# Altium project TimeHAT.PrjPcb
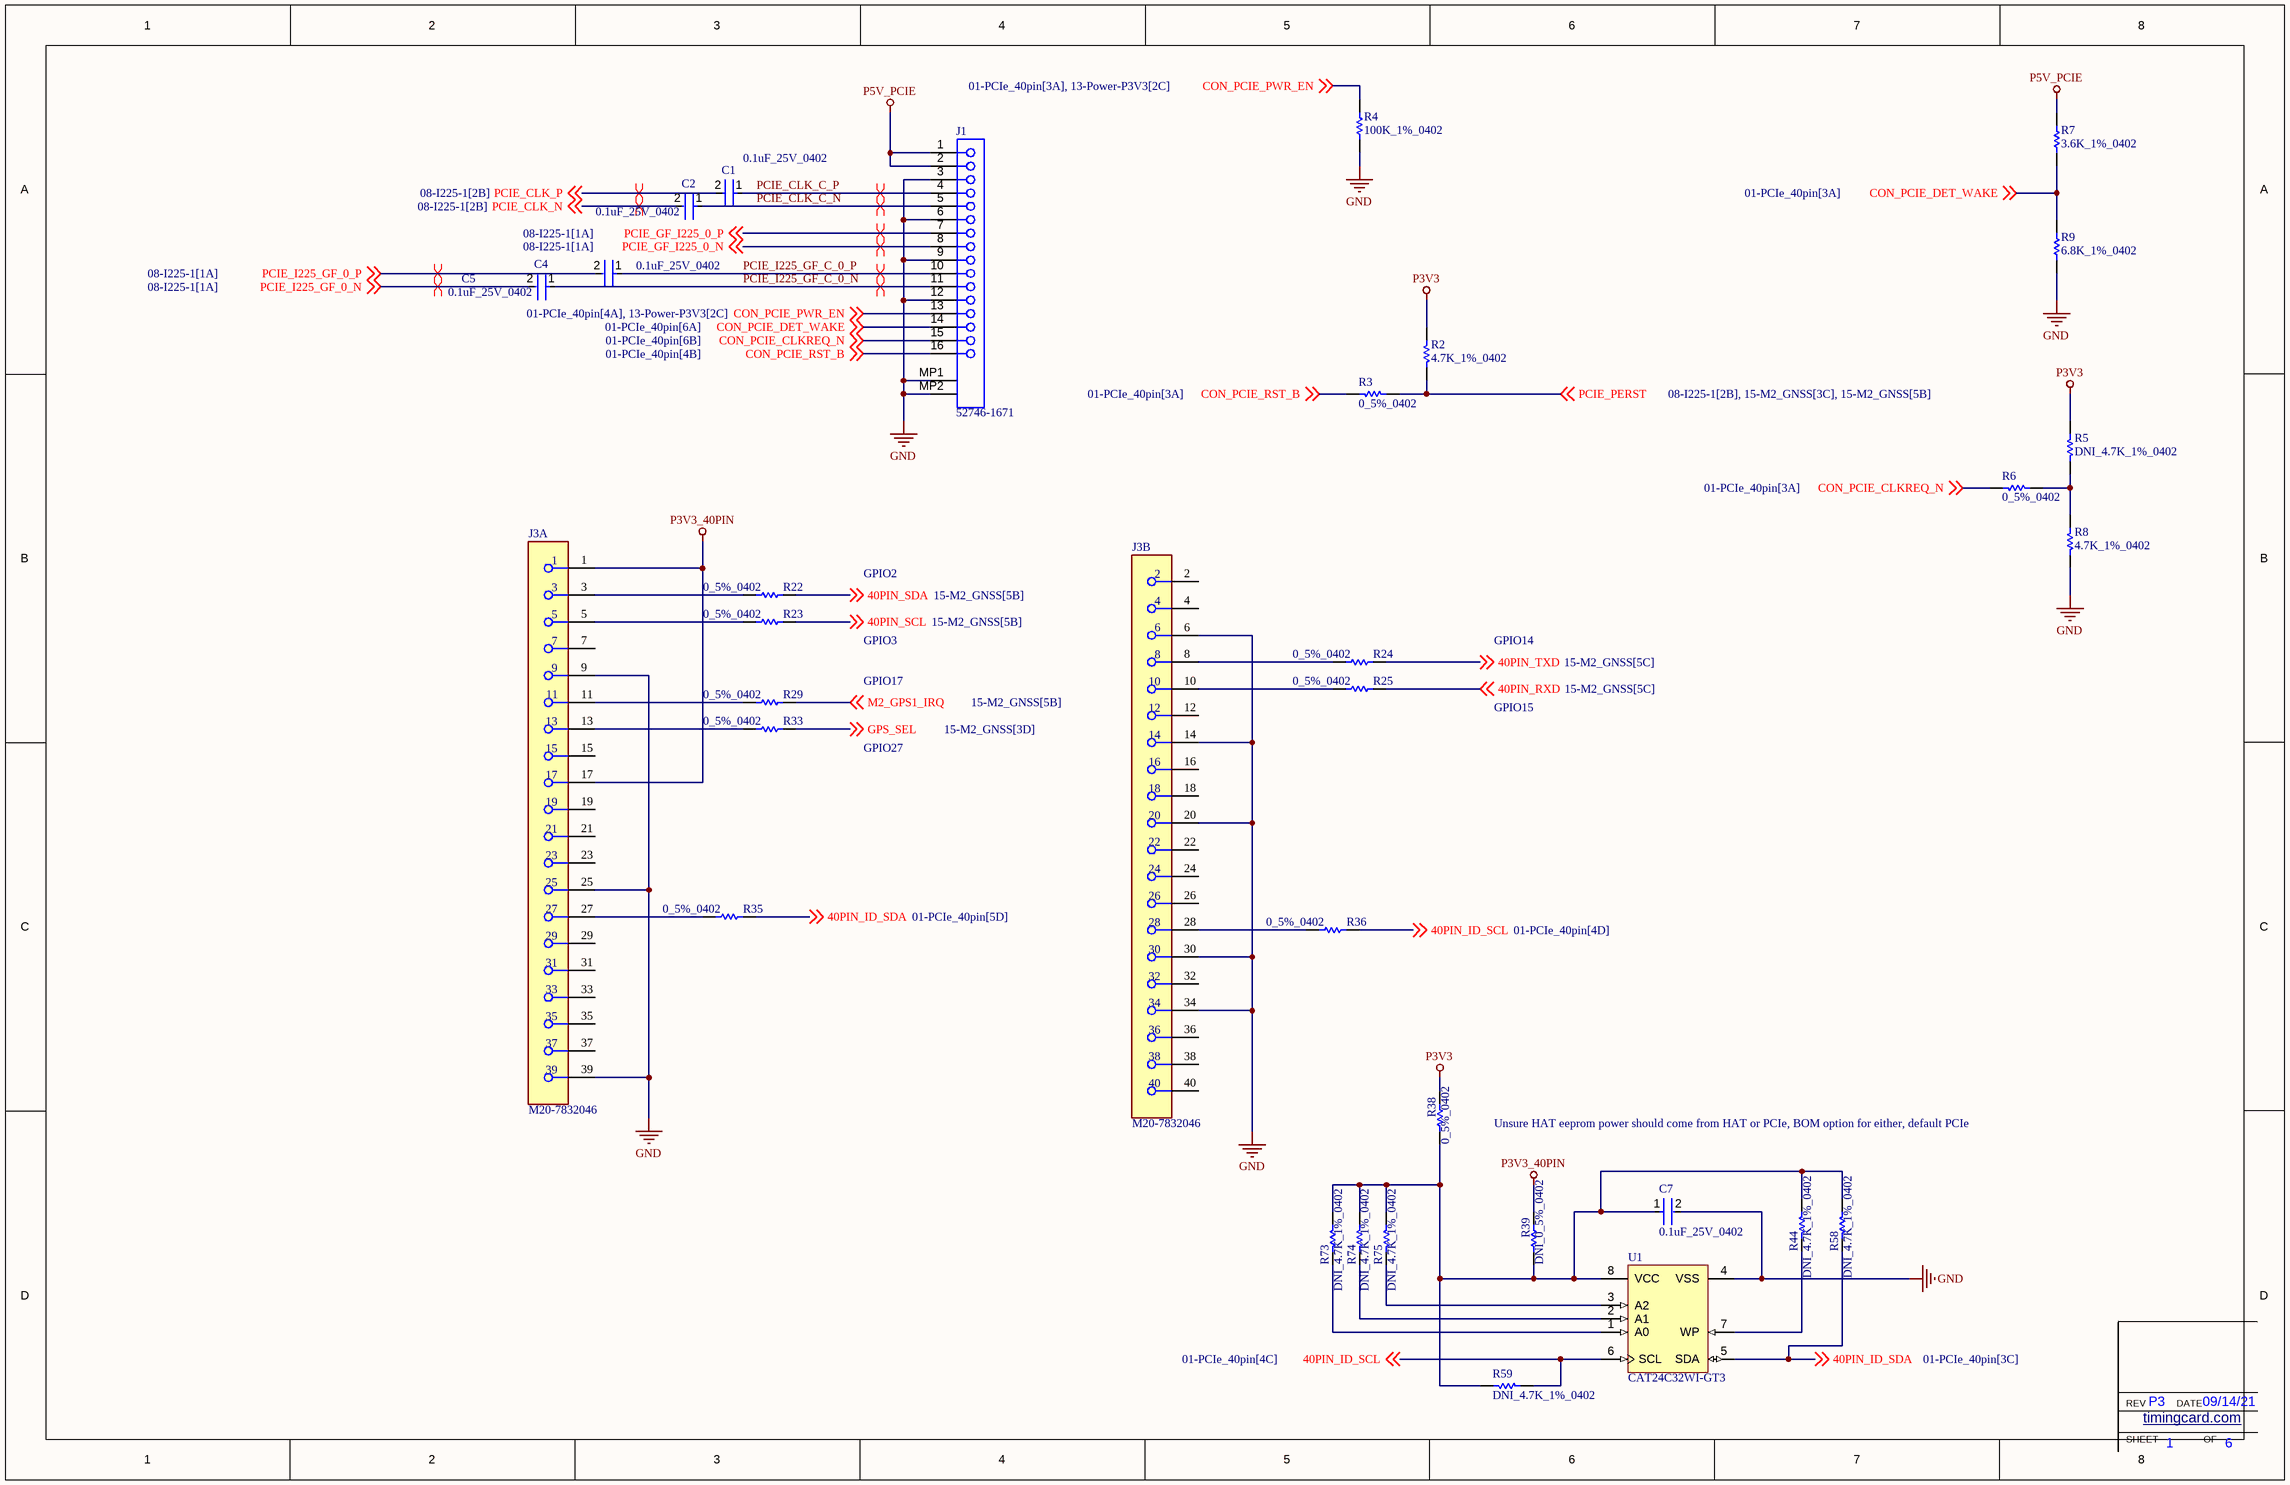
[diagram p0: 01-PCIe_40pin.SchDoc]
ProjectDate: 09/14/21; ProjectRevision: P3
4 sheets, 108 parts. Net scope: global (net labels, ports and power ports of the same name join across sheets).
Board file: TimeHAT.PcbDoc
Sheets:
  01-PCIe_40pin.SchDoc
  02-USER_IO.SchDoc
  08-I225-1.SchDoc
  15-M2_GNSS.SchDoc

## Sheet 01-PCIe_40pin.SchDoc
size Tabloid; Customer: 01910; SheetNumber: 1; SheetTotal: 6

### Parts
C1  0.1uF_25V_0402  [FP-0402-L_1_0_1-W_0_5_0_1-IPC_C]
C2  0.1uF_25V_0402  [FP-0402-L_1_0_1-W_0_5_0_1-IPC_C]
C4  0.1uF_25V_0402  [FP-0402-L_1_0_1-W_0_5_0_1-IPC_C]
C5  0.1uF_25V_0402  [FP-0402-L_1_0_1-W_0_5_0_1-IPC_C]
C7  0.1uF_25V_0402  [FP-0402-L_1_0_1-W_0_5_0_1-IPC_C]
J1  52746-1671  [MOLX-52746-1671]
J3  M20-7832046  [FP-M20-7832046-MFG]  (parts A,B of 2)
R2  4.7K_1%_0402  [RESC1005X40X25NL10T10]
R3  0_5%_0402  [RESC1005X40X25LL10T10]
R4  100K_1%_0402  [RESC1005X40X25ML05T10]
R5  DNI_4.7K_1%_0402  [RESC1005X40X25NL10T10]  (no BOM)
R6  0_5%_0402  [RESC1005X40X25LL10T10]
R7  3.6K_1%_0402  [RESC1005X40X25ML05T10]
R8  4.7K_1%_0402  [RESC1005X40X25NL10T10]
R9  6.8K_1%_0402  [RESC1005X40X25LL10T10]
R22  0_5%_0402  [RESC1005X40X25LL10T10]
R23  0_5%_0402  [RESC1005X40X25LL10T10]
R24  0_5%_0402  [RESC1005X40X25LL10T10]
R25  0_5%_0402  [RESC1005X40X25LL10T10]
R29  0_5%_0402  [RESC1005X40X25LL10T10]
R33  0_5%_0402  [RESC1005X40X25LL10T10]
R35  0_5%_0402  [RESC1005X40X25LL10T10]
R36  0_5%_0402  [RESC1005X40X25LL10T10]
R38  0_5%_0402  [RESC1005X40X25LL10T10]
R39  DNI_0_5%_0402  [RESC1005X40X25LL10T10]  (no BOM)
R44  DNI_4.7K_1%_0402  [RESC1005X40X25NL10T10]  (no BOM)
R58  DNI_4.7K_1%_0402  [RESC1005X40X25NL10T10]  (no BOM)
R59  DNI_4.7K_1%_0402  [RESC1005X40X25NL10T10]  (no BOM)
R73  DNI_4.7K_1%_0402  [RESC1005X40X25NL10T10]  (no BOM)
R74  DNI_4.7K_1%_0402  [RESC1005X40X25NL10T10]  (no BOM)
R75  DNI_4.7K_1%_0402  [RESC1005X40X25NL10T10]  (no BOM)
U1  CAT24C32WI-GT3  [ONSC-SOIC-8-751BD-01_M]

### Nets
GND: C7.2 J1.3 J1.6 J1.9 J1.12 J1.MP1 J1.MP2 J3.6 J3.9 J3.14 J3.20 J3.25 J3.30 J3.34 J3.39 R4.1 R8.1 R9.1 U1.4(VSS)
P3V3: R2.2 R5.2 R38.2
P3V3_40PIN: J3.1 J3.17 R39.2
P5V_PCIE: J1.1 J1.2 R7.2
40PIN_ID_SCL: R36.2 R59.1 U1.6(SCL) ; off-sheet 40PIN_ID_SCL
40PIN_ID_SDA: R35.2 R58.1 U1.5(SDA) ; off-sheet 40PIN_ID_SDA
40PIN_RXD: R25.2 ; off-sheet 40PIN_RXD
40PIN_SCL: R23.2 ; off-sheet 40PIN_SCL
40PIN_SDA: R22.2 ; off-sheet 40PIN_SDA
40PIN_TXD: R24.2 ; off-sheet 40PIN_TXD
CON_PCIE_CLKREQ_N: J1.15 R6.2 ; off-sheet CON_PCIE_CLKREQ_N
CON_PCIE_DET_WAKE: J1.14 R7.1 R9.2 ; off-sheet CON_PCIE_DET_WAKE
CON_PCIE_PWR_EN: J1.13 R4.2 ; off-sheet CON_PCIE_PWR_EN
CON_PCIE_RST_B: J1.16 R3.2 ; off-sheet CON_PCIE_RST_B
GPS_SEL: R33.2 ; off-sheet GPS_SEL
M2_GPS1_IRQ: R29.2 ; off-sheet M2_GPS1_IRQ
PCIE_CLK_C_N: C2.1 J1.5
PCIE_CLK_C_P: C1.1 J1.4
PCIE_CLK_N: C2.2 ; off-sheet PCIE_CLK_N
PCIE_CLK_P: C1.2 ; off-sheet PCIE_CLK_P
PCIE_GF_I225_0_N: J1.8 ; off-sheet PCIE_GF_I225_0_N
PCIE_GF_I225_0_P: J1.7 ; off-sheet PCIE_GF_I225_0_P
PCIE_I225_GF_0_N: C4.2 ; off-sheet PCIE_I225_GF_0_N
PCIE_I225_GF_0_P: C5.2 ; off-sheet PCIE_I225_GF_0_P
PCIE_I225_GF_C_0_N: C4.1 J1.11
PCIE_I225_GF_C_0_P: C5.1 J1.10
PCIE_PERST: R2.1 R3.1 ; off-sheet PCIE_PERST
NetC7_1: C7.1 R38.1 R39.1 R44.2 R58.2 R59.2 R73.2 R74.2 R75.2 U1.8(VCC)
NetJ3_3: J3.3 R22.1
NetJ3_5: J3.5 R23.1
NetJ3_8: J3.8 R24.1
NetJ3_10: J3.10 R25.1
NetJ3_11: J3.11 R29.1
NetJ3_13: J3.13 R33.1
NetJ3_27: J3.27 R35.1
NetJ3_28: J3.28 R36.1
NetR5_1: R5.1 R6.1 R8.2
NetR44_1: R44.1 U1.7(WP)
NetR73_1: R73.1 U1.1(A0)
NetR74_1: R74.1 U1.2(A1)
NetR75_1: R75.1 U1.3(A2)

Not connected (* = marked no-connect by the designer): J3 2 4 7 12 15 16 18 19 21 22 23 24 26 29 31 32 33 35 36 37 38 40

### Layout directives
differential pair: PCIE_CLK_C_N, PCIE_CLK_C_P, PCIE_CLK_N, PCIE_CLK_P, PCIE_GF_I225_0_N, PCIE_GF_I225_0_P, PCIE_I225_GF_0_N, PCIE_I225_GF_0_P, PCIE_I225_GF_C_0_N, PCIE_I225_GF_C_0_P

### Notes on the sheet
- GPIO2
- GPIO17
- GPIO3
- GPIO14
- GPIO27
- GPIO15
- Unsure HAT eeprom power should come from HAT or PCIe, BOM option for either, default PCIe
- SHEET
- REV
- timingcard.com <http://timingcard.com>
- DATE
- OF

### Library data of the parts
C1 C2 C4 C5 C7 = CMP-2008-02519-2: General Purpose Ceramic Capacitor, 0402, 100nF, 10%, X7R, 15%, 25V; Package Quantity: 1; Capacitance: 100nF; Min Operating Temperature: -55°C; Voltage: 25V; Voltage Rating: 25V; Construction: Flat; Max Operating Temperature: 125°C; Radiation Hardening: No; Depth: 0.5mm; Thickness: 0.022inch; Voltage Rating (DC): 25V; Number of Pins: 2; Lead Free: Lead Free; Series: -; REACH SVHC: No SVHC; Length: 1mm; Dielectric: X7R; RoHS Compliant: Yes; Mount: Surface Mount; Packaging: Tape and Reel; Case/Package: 0402; Case Code (Imperial): 0402; Termination: SMD/SMT; Width: 0.02inch; Case Code (Metric): 1005; Tolerance: 10%
J1 = CMP-1241-00378-1: 0.5 mm Pitch Easy-On(TM) Type FPC Connector, 2.0 mm Mated Height, Right Angle, ZIF, SMT, Bottom Contact, 16 Circuits, -20 to 85 degC, ELV and RoHS Compliant, Tape and Reel; Manufacturer: Molex; Voltage (Max): 50V; Durability (mating cycles max): 20; Current (Max per Contact): 0.5A; Pitch - Mating Interface: 0.50mm; PCB Retention: Yes; Stackable: No; Circuits (Loaded): 16; Material - Plating Termination: Gold; Mated Height: 2.00mm; Material - Metal: Phosphor Bronze; Entry Angle: 90degrees Angle; PackageVersion: Rev. H, 05/2009; ComponentLink1URL: http://www.molex.com/molex/index.jsp; PackageReference: 52746-1671; Contact Position: Bottom; Packing: Tape and Reel; Number of Rows: 1; ComponentLink1Description: Manufacturer URL; Mounting Technology: Surface Mount; RoHS: TRUE; Polarized to PCB: Yes; PackageDescription: 16-Lead FPC Connector, Pitch 0.5 mm; ComponentLink3Description: Package Specification; Material - Plating Mating: Gold; ComponentLink3URL: http://www.molex.com/pdm_docs/sd/527461671_sd.pdf; ComponentLink2Description: Datasheet; Orientation: Right Angle; PCB Locator: No; ComponentLink2URL: http://www.molex.com/webdocs/datasheets/pdf/en-us/0527461671_FFC_FPC_CONNECTORS.pdf; PartNumber: 52746-1671
J3 = CMP-15831-000036-1: CONN RCPT 40POS 0.1 TIN PCB; Connector Type: Receptacle; Contact Resistance: 20mR; Pitch: 2.54mm; Insulation Resistance: 1MR; Mating Cycles: 50; Number of Contacts: 40; Max Current Rating: 3A; Hole Diameter: 0.8mm; Row Spacing: 0.1inch; Contact Material: Bronze; RoHS Compliant: Yes; Min Operating Temperature: -40°C; Mount: Through Hole; Gender: Receptacle; Depth: 5.04mm; Package Quantity: 11; Series: M20; REACH SVHC: No SVHC; Color: Black; Lead Pitch: 2.54mm; Max Operating Temperature: 105°C; Orientation: Straight; Radiation Hardening: No; Contact Plating: Tin; Housing Material: Polyamide; Housing Color: Black; Length: 51.2mm; Contact Gender: Female; Number of Positions: 40; Packaging: Rail/Tube; Number of Rows: 2; Material: Glass; Contact Type: Female Socket; Current Rating: 3A; Termination: Solder
R2 R5 R8 R44 R58 R59 R73-R75 = CMP-2002-05217-1: Manufacturer: Bourns; Part Number: CR0402-FX-4701GLF
R3 R6 R22-R25 R29 R33 R35 R36 R38 R39 = CMP-2002-04569-1: Manufacturer: KOA Speer; Part Number: RK73Z1ETTP
R4 = CMP-2002-07852-1: Manufacturer: Yageo; Part Number: RC0402FR-13100KL
R7 = CMP-2002-07657-1: Manufacturer: Yageo / Phycomp; Part Number: RC0402FR-073K6L
R9 = CMP-2002-06323-1: Part Number: MC00625W040216K8; Manufacturer: Multicomp
U1 = CMP-1679-00009-1: I2C CMOS Serial EEPROM, 32 Kb, 1.7 to 5.5 V, -40 to 85 degC, 8-Pin SOIC (751BD), RoHS, Tape and Reel; Case\Package: TO-226-3; hFE Min: 100; Elements: 1; Max Power Dissipation: 625 mW; Frequency: 300 MHz; Vce Max: 1 V; ComponentLink1URL: http://www.onsemi.com/; Mount: Through Hole; REACH SVHC: No SVHC; Packaging: Bulk; Height: 5.33 mm; PackageDescription: 8-Pin Small Outline Integrated Circuit, Body 4.9 x 3.9 mm, Pitch 1.27 mm; ComponentLink2Description: Datasheet; DatasheetVersion: Rev. 24, 06/2015; ComponentLink1Description: Manufacturer URL; PackageReference: SOIC-8-751BD-01; Length: 5.2 mm; ComponentLink2URL: http://www.onsemi.com/pub_link/Collateral/CAT24C32-D.PDF; Pins: 3; Min Operating Temperature: -55 degC; ComponentLink3URL: http://www.onsemi.com/pub_link/Collateral/751BD.PDF; Weight: 0.006314 oz; Max Operating Temperature: 150 degC; Package Quantity: 1000; ComponentLink3Description: Package Specification; Width: 4.19 mm; RoHSCompliant: true; Radiation Hardening: No

## Sheet 02-USER_IO.SchDoc
size Tabloid; DocumentNumber: 1; SheetNumber: 2; SheetTotal: 6
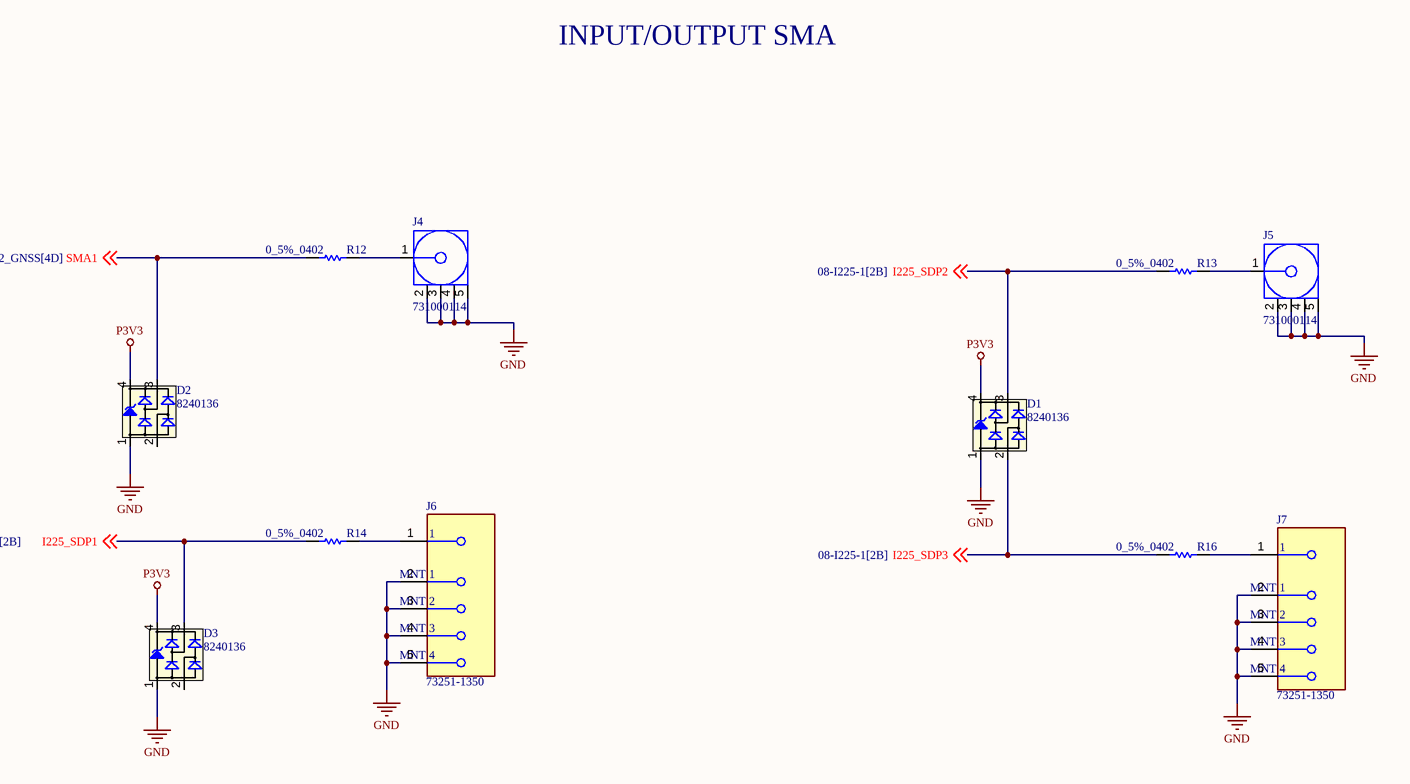
[diagram p1: 02-USER_IO.SchDoc]

### Parts
D1  8240136  [SOT143-4L]
D2  8240136  [SOT143-4L]
D3  8240136  [SOT143-4L]
J4  731000114  [MOLX-731000114_V]
J5  731000114  [MOLX-731000114_V]
J6  73251-1350  [FP-73251-1350-MFG]
J7  73251-1350  [FP-73251-1350-MFG]
R12  0_5%_0402  [RESC1005X40X25LL10T10]
R13  0_5%_0402  [RESC1005X40X25LL10T10]
R14  0_5%_0402  [RESC1005X40X25LL10T10]
R16  0_5%_0402  [RESC1005X40X25LL10T10]

### Nets
GND: D1.1(GND) D2.1(GND) D3.1(GND) J4.2 J4.3 J4.4 J4.5 J5.2 J5.3 J5.4 J5.5 J6.2(MNT_1) J6.3(MNT_2) J6.4(MNT_3) J6.5(MNT_4) J7.2(MNT_1) J7.3(MNT_2) J7.4(MNT_3) J7.5(MNT_4)
P3V3: D1.4(VDD) D2.4(VDD) D3.4(VDD)
I225_SDP1: D3.3(I/O2) R14.1 ; off-sheet I225_SDP1
I225_SDP2: D1.3(I/O2) R13.1 ; off-sheet I225_SDP2
I225_SDP3: D1.2(I/O1) R16.1 ; off-sheet I225_SDP3
SMA1: D2.3(I/O2) R12.1 ; off-sheet SMA1
NetJ4_1: J4.1 R12.2
NetJ5_1: J5.1 R13.2
NetJ6_1: J6.1 R14.2
NetJ7_1: J7.1 R16.2

Not connected (* = marked no-connect by the designer): D2 2(I/O1); D3 2(I/O1)

### Notes on the sheet
- INPUT/OUTPUT SMA
- SHEET
- REV
- timingcard.com <http://timingcard.com>
- DATE
- OF

### Library data of the parts
D1-D3 = CMP-1486-00002-1: TVS Diode WE-TVS-HS, VRWM=3.3V; Manufacturer: Wuerth Elektronik; Reverse Stand Off Voltage: 3.3V; PartNumber: 8240136; ComponentLink1Description: Manufacturer URL; PackageReference: SOT143-4L; ComponentLink1URL: http://www.we-online.com; ComponentLink2Description: Datasheet; ComponentLink2URL: http://katalog.we-online.de/kataloge/eisos/media/pdf/8240136.pdf
J4 J5 = CMP-2000-05487-1: SMA Right-Angle PCB Jack Receptacle, Brass Body, Gold Plated, 50 Ohm, 5-Pin THD, RoHS, Tray; Manufacturer: Molex; Datasheet Version: 09/2016; Package Description: 5-Pin Through Hole Device, Body 14.8 x 6.35 mm, Pitch 2.54 mm; Datasheet URL: http://www.molex.com/webdocs/datasheets/pdf/en-us/0731000114_RF_COAX_CONNECTORS.pdf; Manufacturer URL: http://www.molex.com/; Package Reference: 731000114; Mounting Technology: ThroughHole; Package URL: http://www.molex.com/pdm_docs/sd/731000114_sd.pdf
J6 J7 = CMP-04764-000006-1: CONN SMA JACK STR 50 OHM SMD; Manufacturer: Molex; Is Female: yes; Standoff Height: 0.41mm; Impedance: 50Ω; Number Of Contacts: 1; Conn Orientation: Straight; Voltage Rating: 500V; Shielding: true; Frequency: 18GHz; Package: 73251-1350; Device Class L1: Connectors; Category: Conn; Manufacturer Part Number: 73251-1350; ComponentLink2URL: https://www.molex.com/pdm_docs/sd/732511350_sd.pdf; Automotive: No; Height: 9.655mm; Octopart: https://octopart.com/73251-1350-molex-5414390; Footprint Url: https://forum.upverter.com/uploads/default/original/3X/d/a/daeafa2ce4908d4fc4e49f0b17d7d2c986fce444.pdf; Temperature Range High: +165°C; Device Class L3: unset; Mouser Description: RF Connectors / Coaxial Connectors SMA ST PCB-JCK STD SMT; Lead Free: Yes; Temperature: -65°C to +165°C; RoHS: TRUE; ComponentLink2Description: Datasheet; Device Class L2: RF / Coaxial Connectors; Digikey Description: CONN SMA JACK STR 50 OHM SMD; Contact Material: Gold; Temperature Range Low: -65°C
R12-R14 R16 = CMP-2002-04569-1: as R3 on sheet 01-PCIe_40pin

## Sheet 08-I225-1.SchDoc
size B; SheetNumber: 3; SheetTotal: 6
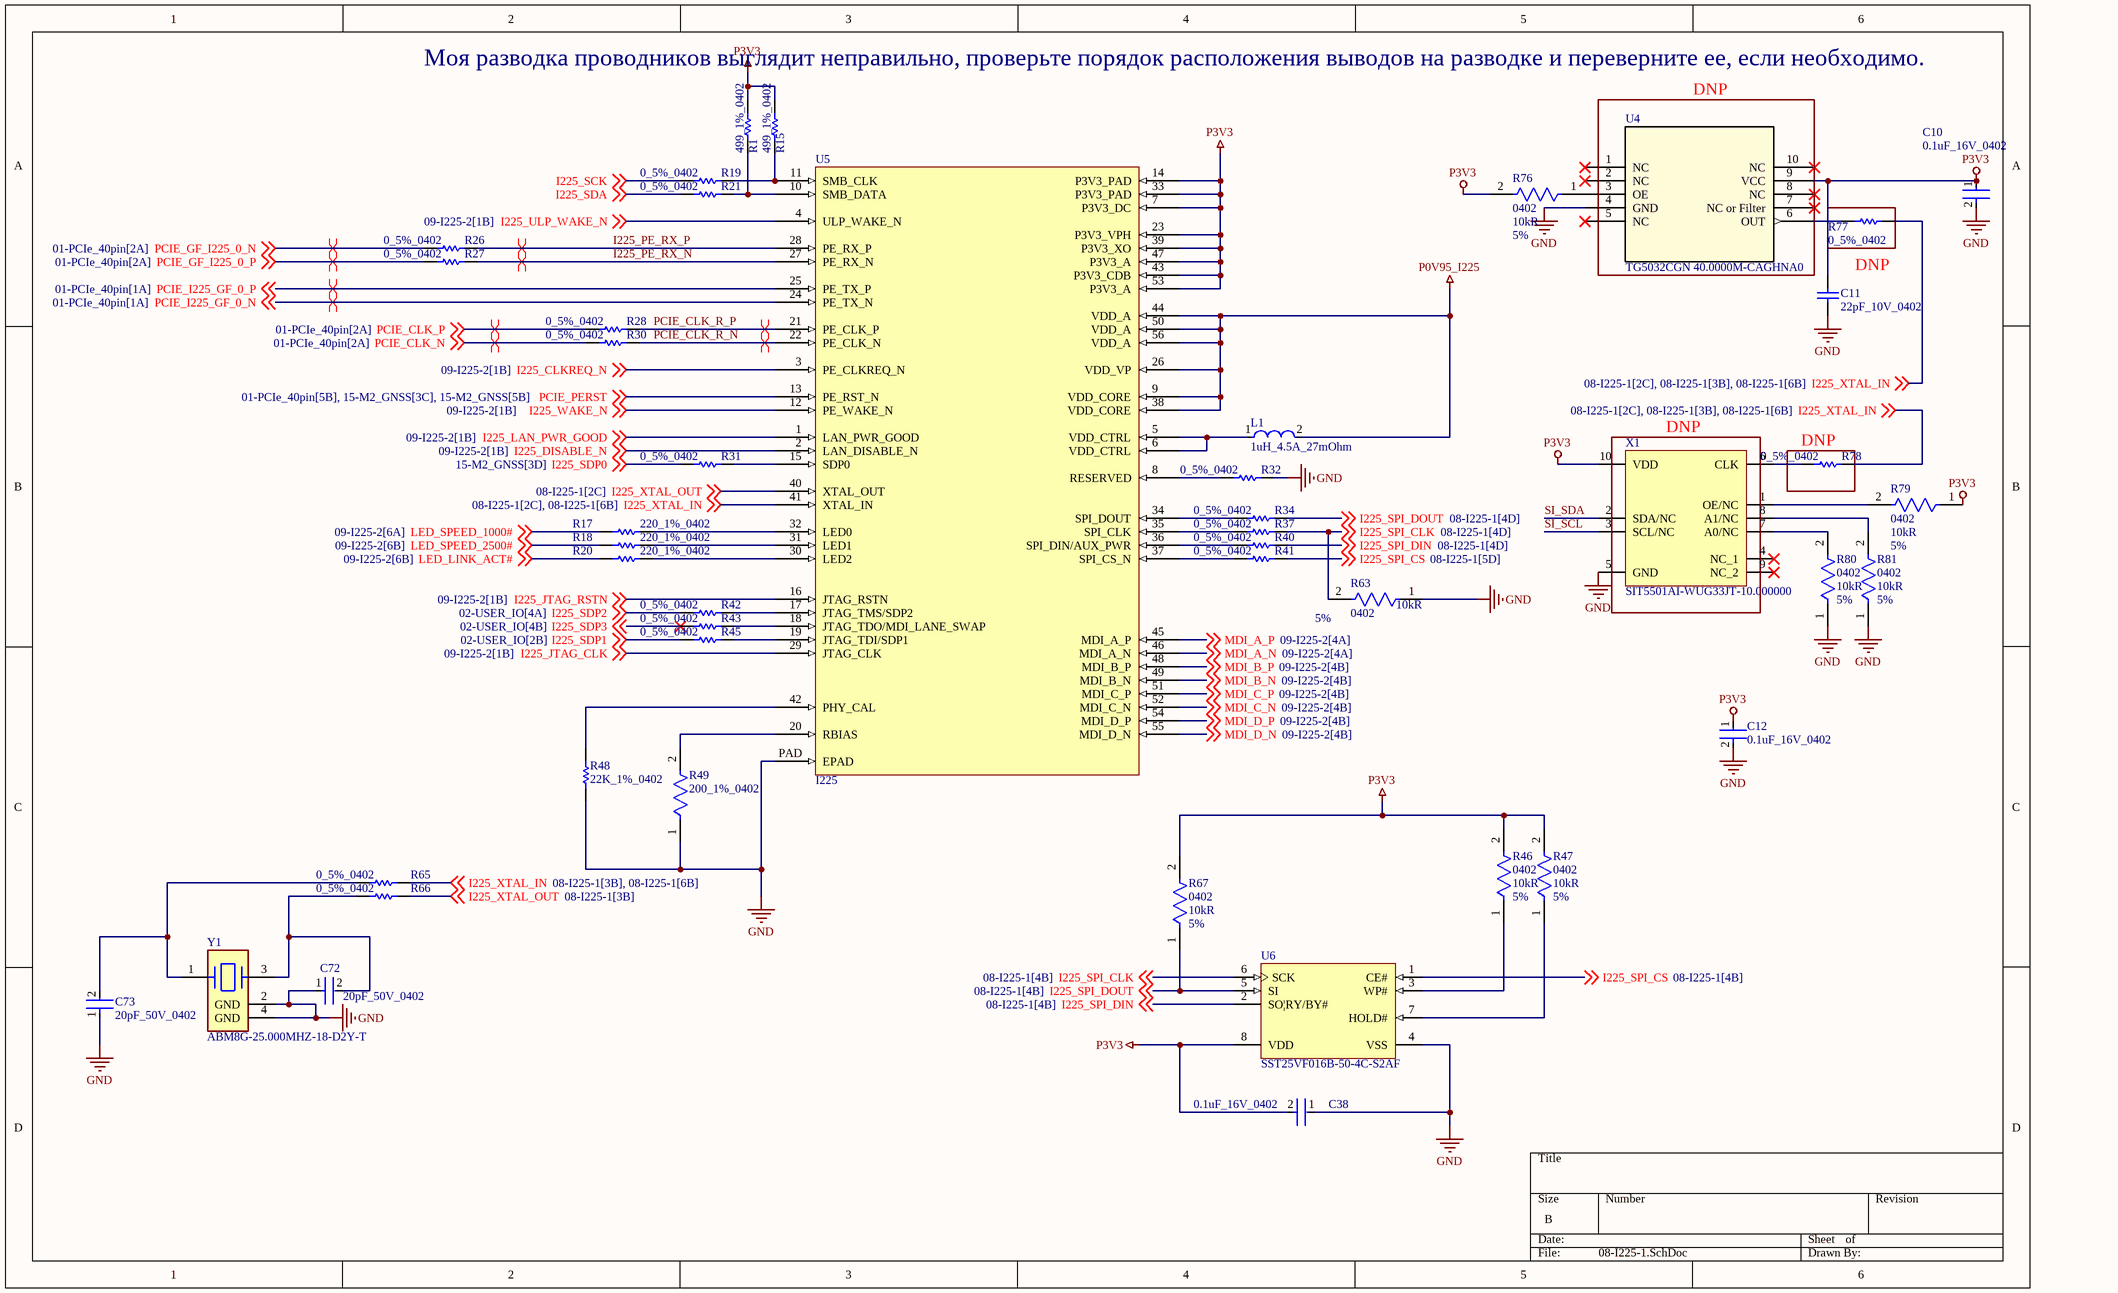
[diagram p2: 08-I225-1.SchDoc]

### Parts
C10  0.1uF_16V_0402  [FP-GRM15-MFG]
C11  22pF_10V_0402  [CAPC1005X56X25LL10T15]
C12  0.1uF_16V_0402  [FP-GRM15-MFG]
C38  0.1uF_16V_0402  [FP-GRM15-MFG]
C72  20pF_50V_0402  [FP-C0402-BB-MFG]
C73  20pF_50V_0402  [FP-C0402-BB-MFG]
L1  1uH_4.5A_27mOhm  [FP-IHLP-1616BZ-FP_1_8545x-MFG]
R1  499_1%_0402  [RESC1005X40X25LL05T05]
R15  499_1%_0402  [RESC1005X40X25LL05T05]
R17  220_1%_0402  [RESC1005X40X25NL10T10]
R18  220_1%_0402  [RESC1005X40X25NL10T10]
R19  0_5%_0402  [RESC1005X40X25LL10T10]
R20  220_1%_0402  [RESC1005X40X25NL10T10]
R21  0_5%_0402  [RESC1005X40X25LL10T10]
R26  0_5%_0402  [RESC1005X40X25LL10T10]
R27  0_5%_0402  [RESC1005X40X25LL10T10]
R28  0_5%_0402  [RESC1005X40X25LL10T10]
R30  0_5%_0402  [RESC1005X40X25LL10T10]
R31  0_5%_0402  [RESC1005X40X25LL10T10]
R32  0_5%_0402  [RESC1005X40X25LL10T10]
R34  0_5%_0402  [RESC1005X40X25LL10T10]
R37  0_5%_0402  [RESC1005X40X25LL10T10]
R40  0_5%_0402  [RESC1005X40X25LL10T10]
R41  0_5%_0402  [RESC1005X40X25LL10T10]
R42  0_5%_0402  [RESC1005X40X25LL10T10]
R43  0_5%_0402  [RESC1005X40X25LL10T10]
R45  0_5%_0402  [RESC1005X40X25LL10T10]
R46  Case/Package: 0402  Resistance: 10kR  Tolerance: 5%  [FP-CRCW0402-e3-IPC_B]  (hidden comment: CRCW040210K0JNED)
R47  Case/Package: 0402  Resistance: 10kR  Tolerance: 5%  [FP-CRCW0402-e3-IPC_B]  (hidden comment: CRCW040210K0JNED)
R48  22K_1%_0402  [RESC1005X40X25NL05T05]
R49  200_1%_0402  [FP-CRCW0402-e3-IPC_C]
R63  Case/Package: 0402  Resistance: 10kR  Tolerance: 5%  [FP-CRCW0402-e3-IPC_B]  (hidden comment: CRCW040210K0JNED)
R65  0_5%_0402  [RESC1005X40X25LL10T10]
R66  0_5%_0402  [RESC1005X40X25LL10T10]
R67  Case/Package: 0402  Resistance: 10kR  Tolerance: 5%  [FP-CRCW0402-e3-IPC_B]  (hidden comment: CRCW040210K0JNED)
R76  Case/Package: 0402  Resistance: 10kR  Tolerance: 5%  [FP-CRCW0402-e3-IPC_B]  (hidden comment: CRCW040210K0JNED)
R77  0_5%_0402  [RESC1005X40X25LL10T10]  (no BOM)
R78  0_5%_0402  [RESC1005X40X25LL10T10]  (no BOM)
R79  Case/Package: 0402  Resistance: 10kR  Tolerance: 5%  [FP-CRCW0402-e3-IPC_B]  (hidden comment: CRCW040210K0JNED)
R80  Case/Package: 0402  Resistance: 10kR  Tolerance: 5%  [FP-CRCW0402-e3-IPC_B]  (hidden comment: CRCW040210K0JNED)
R81  Case/Package: 0402  Resistance: 10kR  Tolerance: 5%  [FP-CRCW0402-e3-IPC_B]  (hidden comment: CRCW040210K0JNED)
U4  TG5032CGN 40.0000M-CAGHNA0  [QFN10_TG5032CGN 40.0000M-CAGHNA0_EPS]  (no BOM)
U5  I225  [I225 QFN56]
U6  SST25VF016B-50-4C-S2AF  [MCHP-SOIC-S2A8_M]
X1  SIT5501AI-WUG33JT-10.000000  [XTAL_SiT5501_70x50]  (no BOM)
Y1  ABM8G-25.000MHZ-18-D2Y-T  [FP-ABM8G-MFG]

### Blocks framed on the sheet
DNP: U4
DNP: X1

### Nets
GND: C10.2 C11.1 C12.2 C38.1 C72.1 C73.1 R32.2 R48.1 R49.1 R63.1 R80.1 R81.1 U4.4(GND) U5.PAD(EPAD) U6.4(VSS) X1.5(GND) Y1.2(GND) Y1.4(GND)
P0V95_I225: L1.2 U5.9(VDD_CORE) U5.26(VDD_VP) U5.38(VDD_CORE) U5.44(VDD_A) U5.50(VDD_A) U5.56(VDD_A)
P3V3: C10.1 C11.2 C12.1 C38.2 R1.2 R15.2 R46.2 R47.2 R67.2 R76.2 R79.1 U4.9(VCC) U5.7(P3V3_DC) U5.14(P3V3_PAD) U5.23(P3V3_VPH) U5.33(P3V3_PAD) U5.39(P3V3_XO) U5.43(P3V3_CDB) U5.47(P3V3_A) U5.53(P3V3_A) U6.8(VDD) X1.10(VDD)
I225_CLKREQ_N: U5.3(PE_CLKREQ_N) ; off-sheet I225_CLKREQ_N
I225_DISABLE_N: U5.2(LAN_DISABLE_N) ; off-sheet I225_DISABLE_N
I225_JTAG_CLK: U5.29(JTAG_CLK) ; off-sheet I225_JTAG_CLK
I225_JTAG_RSTN: U5.16(JTAG_RSTN) ; off-sheet I225_JTAG_RSTN
I225_LAN_PWR_GOOD: U5.1(LAN_PWR_GOOD) ; off-sheet I225_LAN_PWR_GOOD
I225_PE_RX_N: R27.2 U5.27(PE_RX_N)
I225_PE_RX_P: R26.2 U5.28(PE_RX_P)
I225_SCK: R19.1 ; off-sheet I225_SCK
I225_SDA: R21.1 ; off-sheet I225_SDA
I225_SDP0: R31.1 ; off-sheet I225_SDP0
I225_SDP1: R45.1 ; off-sheet I225_SDP1
I225_SDP2: R42.1 ; off-sheet I225_SDP2
I225_SDP3: R43.1 ; off-sheet I225_SDP3
I225_SPI_CLK: R37.2 R63.2 U6.6(SCK) ; off-sheet I225_SPI_CLK
I225_SPI_CS: R41.2 U6.1(CE#) ; off-sheet I225_SPI_CS
I225_SPI_DIN: R40.2 U6.2(SO|RY/BY#) ; off-sheet I225_SPI_DIN
I225_SPI_DOUT: R34.2 R67.1 U6.5(SI) ; off-sheet I225_SPI_DOUT
I225_ULP_WAKE_N: U5.4(ULP_WAKE_N) ; off-sheet I225_ULP_WAKE_N
I225_WAKE_N: U5.12(PE_WAKE_N) ; off-sheet I225_WAKE_N
I225_XTAL_IN: R65.2 R77.2 R78.2 U5.41(XTAL_IN) ; off-sheet I225_XTAL_IN
I225_XTAL_OUT: R66.2 U5.40(XTAL_OUT) ; off-sheet I225_XTAL_OUT
LED_LINK_ACT#: R20.1 ; off-sheet LED_LINK_ACT#
LED_SPEED_1000#: R17.1 ; off-sheet LED_SPEED_1000#
LED_SPEED_2500#: R18.1 ; off-sheet LED_SPEED_2500#
MDI_A_N: U5.46(MDI_A_N) ; off-sheet MDI_A_N
MDI_A_P: U5.45(MDI_A_P) ; off-sheet MDI_A_P
MDI_B_N: U5.49(MDI_B_N) ; off-sheet MDI_B_N
MDI_B_P: U5.48(MDI_B_P) ; off-sheet MDI_B_P
MDI_C_N: U5.52(MDI_C_N) ; off-sheet MDI_C_N
MDI_C_P: U5.51(MDI_C_P) ; off-sheet MDI_C_P
MDI_D_N: U5.55(MDI_D_N) ; off-sheet MDI_D_N
MDI_D_P: U5.54(MDI_D_P) ; off-sheet MDI_D_P
PCIE_CLK_N: R30.1 ; off-sheet PCIE_CLK_N
PCIE_CLK_P: R28.1 ; off-sheet PCIE_CLK_P
PCIE_CLK_R_N: R30.2 U5.22(PE_CLK_N)
PCIE_CLK_R_P: R28.2 U5.21(PE_CLK_P)
PCIE_GF_I225_0_N: R26.1 ; off-sheet PCIE_GF_I225_0_N
PCIE_GF_I225_0_P: R27.1 ; off-sheet PCIE_GF_I225_0_P
PCIE_I225_GF_0_N: U5.24(PE_TX_N) ; off-sheet PCIE_I225_GF_0_N
PCIE_I225_GF_0_P: U5.25(PE_TX_P) ; off-sheet PCIE_I225_GF_0_P
PCIE_PERST: U5.13(PE_RST_N) ; off-sheet PCIE_PERST
SI_SCL: X1.3(SCL/NC)
SI_SDA: X1.2(SDA/NC)
NetC72_2: C72.2 R66.1 Y1.3
NetC73_2: C73.2 R65.1 Y1.1
NetL1_1: L1.1 U5.5(VDD_CTRL) U5.6(VDD_CTRL)
NetR1_1: R1.1 R21.2 U5.10(SMB_DATA)
NetR15_1: R15.1 R19.2 U5.11(SMB_CLK)
NetR17_2: R17.2 U5.32(LED0)
NetR18_2: R18.2 U5.31(LED1)
NetR20_2: R20.2 U5.30(LED2)
NetR31_2: R31.2 U5.15(SDP0)
NetR32_1: R32.1 U5.8(RESERVED)
NetR34_1: R34.1 U5.34(SPI_DOUT)
NetR37_1: R37.1 U5.35(SPI_CLK)
NetR40_1: R40.1 U5.36(SPI_DIN/AUX_PWR)
NetR41_1: R41.1 U5.37(SPI_CS_N)
NetR42_2: R42.2 U5.17(JTAG_TMS/SDP2)
NetR43_2: R43.2 U5.18(JTAG_TDO/MDI_LANE_SWAP)
NetR45_2: R45.2 U5.19(JTAG_TDI/SDP1)
NetR46_1: R46.1 U6.3(WP#)
NetR47_1: R47.1 U6.7(HOLD#)
NetR48_2: R48.2 U5.42(PHY_CAL)
NetR49_2: R49.2 U5.20(RBIAS)
NetR76_1: R76.1 U4.3(OE)
NetR77_1: R77.1 U4.6(OUT)
NetR78_1: R78.1 X1.6(CLK)
NetR79_2: R79.2 X1.1(OE/NC)
NetR80_2: R80.2 X1.7(A0/NC)
NetR81_2: R81.2 X1.8(A1/NC)

Not connected (* = marked no-connect by the designer): U4 1(NC)* 2(NC)* 5(NC)* 7(NC_or_Filter)* 8(NC)* 10(NC)*; X1 4(NC_1)* 9(NC_2)*

### Layout directives
differential pair: I225_PE_RX_N, I225_PE_RX_P, PCIE_CLK_N, PCIE_CLK_P, PCIE_CLK_R_N, PCIE_CLK_R_P, PCIE_GF_I225_0_N, PCIE_GF_I225_0_P, PCIE_I225_GF_0_N, PCIE_I225_GF_0_P

### Notes on the sheet
- Моя разводка проводников выглядит неправильно, проверьте порядок расположения выводов на разводке и переверните ее, если необходимо.
- DNP
- (near R78) DNP

### Library data of the parts
C10 C12 C38 = CMP-2100-03641-2: CAP CER 0.1UF 16V X7R 0402; Manufacturer Part Number: GRM155R71C104KA88D; Manufacturer: Murata; Standoff Height: 0mm; Tolerance: 10%; Voltage Rating: 16Vdc; Material: Ceramic; Capacitance: 0.10μF; Value: 0.10μF; RoHS: TRUE; Temperature Characteristic: X7R; Octopart: https://octopart.com/grm155r71c104ka88d-murata-196880; Digikey Description: CAP CER 0.1UF 16V X7R 0402; Device Class L3: Ceramic Capacitors; Height: 0.55mm; ComponentLink2Description: Datasheet; Temperature Range Low: -55°C; Ipc Land Pattern Name: CAPC10050X219; ComponentLink2URL: https://search.murata.co.jp/Ceramy/image/img/A01X/G101/ENG/GRM155R71H471KA01-01A.pdf; Device Class L1: Passive Components; Lead Free: yes; Category: Cap; Package: GRM15; Temperature: -55°C to +125°C; Device Class L2: Capacitors; Temperature Range High: +125°C; Mouser Description: 0402 0.1 uF 16V ±10 % Tolerance X7R SMT Multilayer Ceramic Capacitor
C11 = CMP-2008-02855-1: Part Number: 0402ZA220JAT2A; Manufacturer: AVX Interconnect / Elco
C72 C73 = CMP-1034-00890-3: CAP CER 20PF 50V 5% NP0 0402; Manufacturer Part Number: C0402C200J5GACTU; Manufacturer: Kemet; Tolerance: 0.05; Material: Ceramic; Temperature Characteristic: C0G; Temperature Coefficient: 15%; Octopart: https://octopart.com/c0402c200j5gactu-kemet-9143900; ComponentLink2Description: Datasheet; RoHS: TRUE; Ipc Land Pattern Name: CAPC10050X50; Temperature: -55°C to +125°C; Lead Free: Yes; Mouser Description: Multilayer Ceramic Capacitors MLCC - SMD/SMT 50volts 20pF C0G 5%; Device Class L1: Passive Components; Category: Cap; Package: C0402-BB; Temperature Range High: +125°C; Voltage Rating: 50 V; Temperature Range Low: -55°C; Device Class L2: Capacitors; Device Class L3: Ceramic Capacitors; Height: 0.55mm; Capacitance: 20 pF; Value: 20 pF; ComponentLink2URL: https://content.kemet.com/datasheets/KEM_C1002_X7R_SMD.pdf; Digikey Description: CAP CER 20PF 50V 5% NP0 0402; Automotive: No
L1 = CMP-02424-000223-1: Fixed Inductors Commercial Low DCR Series SMT 1uH 4.5A 27mΩ 20%; DC Resistance (DCR): 27mR; Core Material: Ferrite; Test Frequency: 100kHz; Shielding: Shielded; Self Resonant Frequency: 64MHz; Saturation Current: 5A; Inductance Tolerance: 20%; Min Operating Temperature: -55°C; Lead Free: Lead Free; Inductance: 1uH; Contact Plating: Tin; Package Quantity: 4000; Military Standard: Not; Depth: 4.31mm; Tolerance: 20%; RMS Current (Irms): 4.5A; Packaging: Tape and Reel; Number of Pins: 1616; Case/Package: 1616; Termination: SMD/SMT; Height: 2mm; Current Rating: 4.5A; Case Code (Metric): 4040; Max Operating Temperature: 125°C; Case Code (Imperial): 1616; Max DC Current: 4.5A; Width: 0.16inch; Mount: Surface Mount; Length: 4.7mm; Radiation Hardening: No; Height - Seated (Max): 0.079inch
R1 R15 = CMP-2002-00965-1: Manufacturer: Panasonic; Part Number: ERJ-2RKF4990X
R17 R18 R20 = CMP-2002-06050-1: Part Number: MC00625W04021220R; Manufacturer: Multicomp
R19 R21 R26-R28 R30-R32 R34 R37 R40-R43 R45 R65 R66 R77 R78 = CMP-2002-04569-1: as R3 on sheet 01-PCIe_40pin
R46 R47 R63 R67 R76 R79-R81 = CMP-2002-08136-3: RES Thick Film, 10kΩ, 5%, 0.063W, 200ppm/°C, 0402; Voltage Rating: 50V; Power Rating: 63mW; Military Standard: Not; Packaging: Tape and Reel; Case Code (Imperial): 0402; Min Operating Temperature: -55°C; Case Code (Metric): 1005; Temperature Coefficient: 200ppm/°C; Termination: SMD/SMT; Composition: Thick Film; Depth: 0.5mm; Number of Terminations: 2; Contact Plating: Tin; Height: 0.016inch; Width: 0.5mm; Max Operating Temperature: 155°C; Features: Automotive AEC-Q200; Length: 1mm; Radiation Hardening: No; Max Power Dissipation: 63mW; Mount: Surface Mount; Package Quantity: 1; Weight: 2.3E-05oz
R48 = CMP-1011-00659-2: Part Number: CRCW040222K0FKED; Manufacturer: Vishay Dale
R49 = CMP-1011-00429-3: RES Thick Film, 200Ω, 1%, 0.063W, 100ppm/°C, 0402; Max Power Dissipation: 63mW; Voltage Rating: 50V; Resistance: 200R; Termination: SMD/SMT; Weight: 2.3E-05oz; Case/Package: 0402; Contact Plating: Tin; Number of Pins: 2; Width: 0.5mm; Height: 0.35mm; Case Code (Metric): 1005; Military Standard: Not; Features: Automotive AEC-Q200; Power Rating: 63mW; Temperature Coefficient: 100ppm/°C; Tolerance: 1%; Lead Free: Lead Free; Depth: 0.5mm; Max Operating Temperature: 155°C; Min Operating Temperature: -55°C; Package Quantity: 10; Voltage Rating (DC): 50V; Composition: Thick Film; Mount: Surface Mount; Radiation Hardening: No; Length: 1mm; Packaging: Tape and Reel; Number of Terminations: 2; Case Code (Imperial): 0402
U4 = TG5032CGN 40.0000M-CAGHNA0: No Description Available; Mfr_Name: Epson; Copyright: Copyright (C) 2024 Ultra Librarian. All rights reserved.; Manufacturer_Part_Number: TG5032CGN 40.0000M-CAGHNA0; RefDes: RefDes; Type: DEV
U6 = CMP-0378-00041-1: 16 Mbit SPI Serial Flash, 2.7 to 3.6 V, 50 MHz, 0 to 70 degC, 8-pin SOIC (S2A8), Tube; Manufacturer: Microchip; PackageReference: SOIC-S2A8; PackageVersion: Rev. A; ComponentLink3URL: http://ww1.microchip.com/downloads/en/DeviceDoc/25051A.pdf; ComponentLink1Description: Manufacturer URL; ComponentLink4URL: http://www.microchip.com/SST25VF016B; ComponentLink1URL: http://www.microchip.com; DatasheetVersion: Rev. A; ComponentLink2URL: http://ww1.microchip.com/downloads/en/DeviceDoc/25044A.pdf; PackageDescription: 8-Lead Plastic Small Outline Intergrated Circuit, 5.275 x 5.275 mm Body, 1.27 mm Pitch; PartNumber: SST25VF016B-50-4C-S2AF; ComponentLink3Description: Package Specification; ComponentLink2Description: Datasheet; Mounting Technology: Surface Mount; ComponentLink4Description: Product URL
X1 = XTAL_SIT5501AI-WUG33JT-10.000000: 1 MHz  60 MHz, Elite X Stratum 3E Precision Oscillator; Manufacturer_Name: SiTime; Geometry.Height: 2.2mm; Manufacturer_Part_Number: SIT5501AI-WUG33JT-10.000000; Mouser Part Number: *; Mouser Price/Stock: *; Arrow Part Number: *; Arrow Price/Stock: *; Mouser Testing Part Number: *; Mouser Testing Price/Stock: *; Datasheet Link: https://www.sitime.com/support/resource-library/datasheets/sit5501-datasheet
Y1 = CMP-2000-05733-2: CRYSTAL 25.0000MHZ 18PF SMD; Manufacturer: Abracon; Stability: 30ppm; Frequency: 25MHz; Esr: 60Ω; Tolerance: 20ppm; Automotive: No; Series: ABM8G; Temperature Range High: +85°C; ComponentLink2URL: https://abracon.com/Resonators/ABM8G.pdf; RoHS: TRUE; Octopart: https://octopart.com/abm8g-25.000mhz-18-d2y-t-abracon-12676602; Package: ABM8G; Category: Crys; Device Class L2: Crystals / Oscillators; ComponentLink2Description: Datasheet; Manufacturer Part Number: ABM8G-25.000MHZ-18-D2Y-T; Height: 1mm; Lead Free: Yes; Digikey Description: CRYSTAL 25.0000MHZ 18PF SMD; Temperature Range Low: -40°C; Device Class L3: Crystals; Load Capacitance: 18pF; Temperature: -40°C to +85°C; Device Class L1: Passive Components; Mouser Description: Crystals 25.000MHz 18pF 30ppm -40C +85C

## Sheet 15-M2_GNSS.SchDoc
size C; SheetNumber: 6; SheetTotal: 6
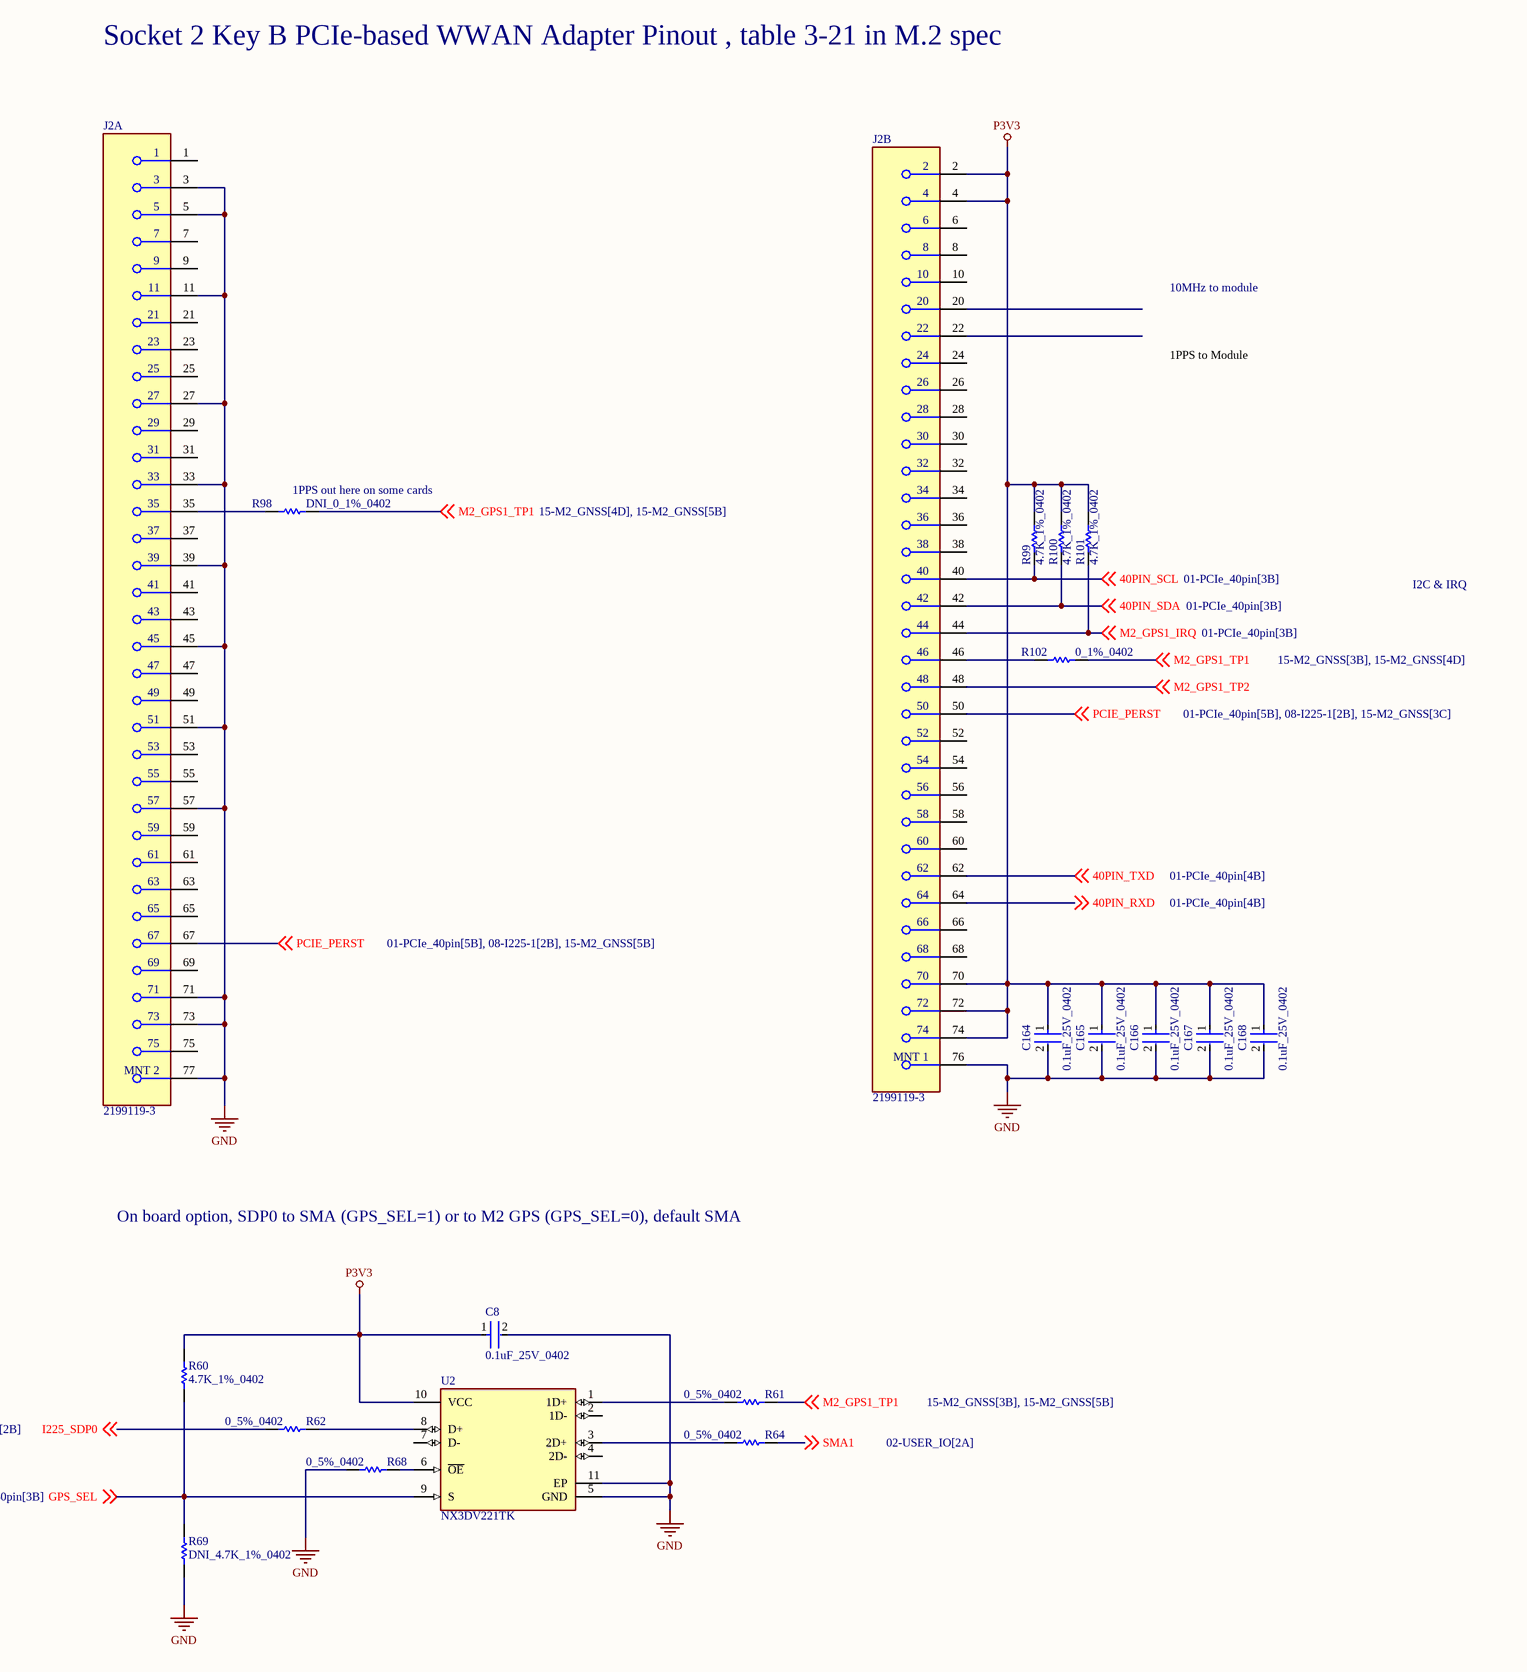
[diagram p3: 15-M2_GNSS.SchDoc]

### Parts
C8  0.1uF_25V_0402  [FP-0402-L_1_0_1-W_0_5_0_1-IPC_C]
C164  0.1uF_25V_0402  [FP-0402-L_1_0_1-W_0_5_0_1-IPC_C]
C165  0.1uF_25V_0402  [FP-0402-L_1_0_1-W_0_5_0_1-IPC_C]
C166  0.1uF_25V_0402  [FP-0402-L_1_0_1-W_0_5_0_1-IPC_C]
C167  0.1uF_25V_0402  [FP-0402-L_1_0_1-W_0_5_0_1-IPC_C]
C168  0.1uF_25V_0402  [FP-0402-L_1_0_1-W_0_5_0_1-IPC_C]
J2  2199119-3  [FP-2199119-3-MFG]  (parts A,B of 2)
R60  4.7K_1%_0402  [RESC1005X40X25NL10T10]
R61  0_5%_0402  [RESC1005X40X25LL10T10]
R62  0_5%_0402  [RESC1005X40X25LL10T10]
R64  0_5%_0402  [RESC1005X40X25LL10T10]
R68  0_5%_0402  [RESC1005X40X25LL10T10]
R69  DNI_4.7K_1%_0402  [RESC1005X40X25NL10T10]  (no BOM)
R98  DNI_0_1%_0402  [RESC1005X40X25LL05T05]  (no BOM)
R99  4.7K_1%_0402  [RESC1005X40X25NL10T10]
R100  4.7K_1%_0402  [RESC1005X40X25NL10T10]
R101  4.7K_1%_0402  [RESC1005X40X25NL10T10]
R102  0_1%_0402  [RESC1005X40X25LL05T05]
U2  NX3DV221TK  [FP-SOT650-2-MFG]

### Nets
GND: C8.2 C164.2 C165.2 C166.2 C167.2 C168.2 J2.3 J2.5 J2.11 J2.27 J2.33 J2.39 J2.45 J2.51 J2.57 J2.71 J2.73 J2.76(MNT_1) J2.77(MNT_2) R68.1 R69.2 U2.5(GND) U2.11(EP)
P3V3: C8.1 C164.1 C165.1 C166.1 C167.1 C168.1 J2.2 J2.4 J2.70 J2.72 J2.74 R60.1 R99.2 R100.2 R101.2 U2.10(VCC)
40PIN_RXD: J2.64 ; off-sheet 40PIN_RXD
40PIN_SCL: J2.40 R99.1 ; off-sheet 40PIN_SCL
40PIN_SDA: J2.42 R100.1 ; off-sheet 40PIN_SDA
40PIN_TXD: J2.62 ; off-sheet 40PIN_TXD
GPS_SEL: R60.2 R69.1 U2.9(S) ; off-sheet GPS_SEL
I225_SDP0: R62.1 ; off-sheet I225_SDP0
M2_GPS1_IRQ: J2.44 R101.1 ; off-sheet M2_GPS1_IRQ
M2_GPS1_TP1: R61.2 R98.2 R102.2 ; off-sheet M2_GPS1_TP1
M2_GPS1_TP2: J2.48 ; off-sheet M2_GPS1_TP2
PCIE_PERST: J2.50 J2.67 ; off-sheet PCIE_PERST
SMA1: R64.2 ; off-sheet SMA1
NetJ2_35: J2.35 R98.1
NetJ2_46: J2.46 R102.1
NetR61_1: R61.1 U2.1(1D+)
NetR62_2: R62.2 U2.8(D+)
NetR64_1: R64.1 U2.3(2D+)
NetR68_2: R68.2 U2.6(~{OE})

Not connected (* = marked no-connect by the designer): J2 1 6 7 8 9 10 20 21 22 23 24 25 26 28 29 30 31 32 34 36 37 38 41 43 47 49 52 53 54 55 56 58 59 60 61 63 65 66 68 69 75; U2 2(1D-) 4(2D-) 7(D-)

### Notes on the sheet
- Socket 2 Key B PCIe-based WWAN Adapter Pinout , table 3-21 in M.2 spec
- 10MHz to module
- 1PPS to Module
- (near R98) 1PPS out here on some cards
- I2C & IRQ
- On board option, SDP0 to SMA (GPS_SEL=1) or to M2 GPS (GPS_SEL=0), default SMA

### Library data of the parts
C8 C164-C168 = CMP-2008-02519-2: as C1 on sheet 01-PCIe_40pin; Package Quantity: 1; Capacitance: 100nF; Min Operating Temperature: -55°C; Voltage: 25V; Voltage Rating: 25V; Construction: Flat; Max Operating Temperature: 125°C; Radiation Hardening: No; Depth: 0.5mm; Thickness: 0.022inch; Voltage Rating (DC): 25V; Number of Pins: 2; Lead Free: Lead Free; Series: -; REACH SVHC: No SVHC; Length: 1mm; Dielectric: X7R; RoHS Compliant: Yes; Mount: Surface Mount; Packaging: Tape and Reel; Case/Package: 0402; Case Code (Imperial): 0402; Termination: SMD/SMT; Width: 0.02inch; Case Code (Metric): 1005; Tolerance: 10%
J2 = CMP-03365-000004-1: CONN M.2 FEMALE 67POS 0.020 GOLD; Contact Current Rating: 500mA; Number of Contacts: 67; PCB Mounting Orientation: Right Angle; Pitch: 0.5mm; Voltage Rating: 50V; Insulation Resistance: 500MR; Row Spacing: 7.55mm; Orientation: Right Angle; Length: 0.862inch; Radiation Hardening: No; Mount: Surface Mount; Contact Plating: Gold; Contact Material: Copper Alloy; Width: 8.7mm; Number of Rows: 2; Color: Black; ELV: Compliant; Housing Color: Black; Number of Positions: 67; Housing Material: Thermoplastic; Gender: Female; Min Operating Temperature: -40°C; Max Operating Temperature: 80°C; RoHS Compliant: Yes; Package Quantity: 1200; Packaging: Tape and Reel; Height: 3.2mm; Termination: Solder; Insulation Material: Thermoplastic; Max Voltage Rating (AC): 50V; Current Rating: 500mA
R60 R69 R99-R101 = CMP-2002-05217-1: as R2 on sheet 01-PCIe_40pin
R61 R62 R64 R68 = CMP-2002-04569-1: as R3 on sheet 01-PCIe_40pin
R98 R102 = CMP-2000-07451-1: Chip Resistor, 0 Ohm, 0.1 W, -55 to 155 degC, 0402 (1005 Metric), RoHS, Tape and Reel; Manufacturer: Panasonic; Voltage Rating (DC): 50V; Temperature Coefficient: 600ppm/��C; Max Power Dissipation: 100mW; Resistance: 0mOhm; Tolerance: 5%; Number of Terminations: 2; Mount: SurfaceMount; Height: 0.35mm; Packaging: TapeandReel; Contact Plating: Tin; Manufacturer URL: http://www.panasonic.com/; Composition: ThickFilm; Max Operating Temperature: 155degC; REACH SVHC: NoSVHC; Case/Package: 0402; Package Reference: 402; Depth: 0.5mm; Package Description: 2-Pin Surface Mount Device, Body 1 x 0.5 mm; Datasheet URL: https://industrial.panasonic.com/cdbs/www-data/pdf/RDA0000/AOA0000C301.pdf; RoHSCompliant: True; Case Code (Imperial): 0402; Military Standard: Not; Min Operating Temperature: -55degC; Power Rating: 100mW; Datasheet Version: 03/2015; Length: 1mm; Case Code (Metric): 1005; Termination: SMD/SMT; Mounting Technology: SurfaceMount; Voltage Rating: 50V; Width: 0.02inch; Package Quantity: 1; Lead Free: LeadFree; Radiation Hardening: No
U2 = CMP-10103-000005-1: USB Switch IC 1 Channel 10-HVSON (3x3); RoHS Compliant: Yes

## Nets that join several sheets
GND: 01-PCIe_40pin (19 pins), 02-USER_IO (19 pins), 08-I225-1 (18 pins), 15-M2_GNSS (23 pins)
P3V3: 01-PCIe_40pin (R2.2 R5.2 R38.2), 02-USER_IO (D1.4 D2.4 D3.4), 08-I225-1 (22 pins), 15-M2_GNSS (16 pins)
40PIN_RXD: 01-PCIe_40pin (R25.2), 15-M2_GNSS (J2.64)
40PIN_SCL: 01-PCIe_40pin (R23.2), 15-M2_GNSS (J2.40 R99.1)
40PIN_SDA: 01-PCIe_40pin (R22.2), 15-M2_GNSS (J2.42 R100.1)
40PIN_TXD: 01-PCIe_40pin (R24.2), 15-M2_GNSS (J2.62)
GPS_SEL: 01-PCIe_40pin (R33.2), 15-M2_GNSS (R60.2 R69.1 U2.9)
I225_SDP0: 08-I225-1 (R31.1), 15-M2_GNSS (R62.1)
I225_SDP1: 02-USER_IO (D3.3 R14.1), 08-I225-1 (R45.1)
I225_SDP2: 02-USER_IO (D1.3 R13.1), 08-I225-1 (R42.1)
I225_SDP3: 02-USER_IO (D1.2 R16.1), 08-I225-1 (R43.1)
M2_GPS1_IRQ: 01-PCIe_40pin (R29.2), 15-M2_GNSS (J2.44 R101.1)
PCIE_CLK_N: 01-PCIe_40pin (C2.2), 08-I225-1 (R30.1)
PCIE_CLK_P: 01-PCIe_40pin (C1.2), 08-I225-1 (R28.1)
PCIE_GF_I225_0_N: 01-PCIe_40pin (J1.8), 08-I225-1 (R26.1)
PCIE_GF_I225_0_P: 01-PCIe_40pin (J1.7), 08-I225-1 (R27.1)
PCIE_I225_GF_0_N: 01-PCIe_40pin (C4.2), 08-I225-1 (U5.24)
PCIE_I225_GF_0_P: 01-PCIe_40pin (C5.2), 08-I225-1 (U5.25)
PCIE_PERST: 01-PCIe_40pin (R2.1 R3.1), 08-I225-1 (U5.13), 15-M2_GNSS (J2.50 J2.67)
SMA1: 02-USER_IO (D2.3 R12.1), 15-M2_GNSS (R64.2)